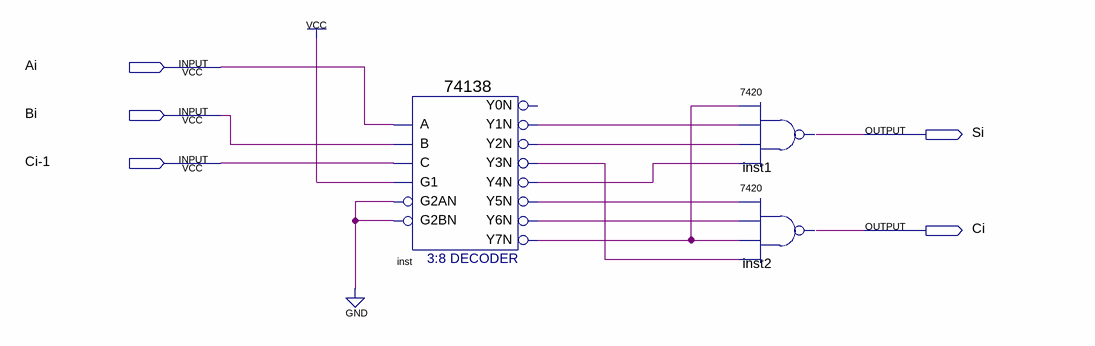
[diagram p0: schematic sheet]
// Quartus schematic Block1.bdf as structural Verilog: 3 symbols, 5 pins
module Block1 (
  input  Ai,
  input  Bi,
  input  \Ci-1 ,
  output Si,
  output Ci
);

  wire inst_y1n, inst_y2n, inst_y3n, inst_y4n, inst_y5n, inst_y6n, inst_y7n;

  \74138  inst (
    .A(Ai), .B(Bi), .G1(1'b1), .C(\Ci-1 ), .G2AN(1'b0), .G2BN(1'b0), .Y1N(inst_y1n), .Y2N(inst_y2n),
    .Y3N(inst_y3n), .Y4N(inst_y4n), .Y5N(inst_y5n), .Y6N(inst_y6n), .Y7N(inst_y7n));  // open: Y0N
  \7420  inst1 (.\4 (inst_y2n), .\2 (inst_y7n), .\3 (inst_y1n), .\5 (inst_y4n), .\1 (Si));
  \7420  inst2 (.\4 (inst_y7n), .\2 (inst_y5n), .\3 (inst_y6n), .\5 (inst_y3n), .\1 (Ci));
endmodule
